# Altium schematic sheet LNA.SchDoc
size A4
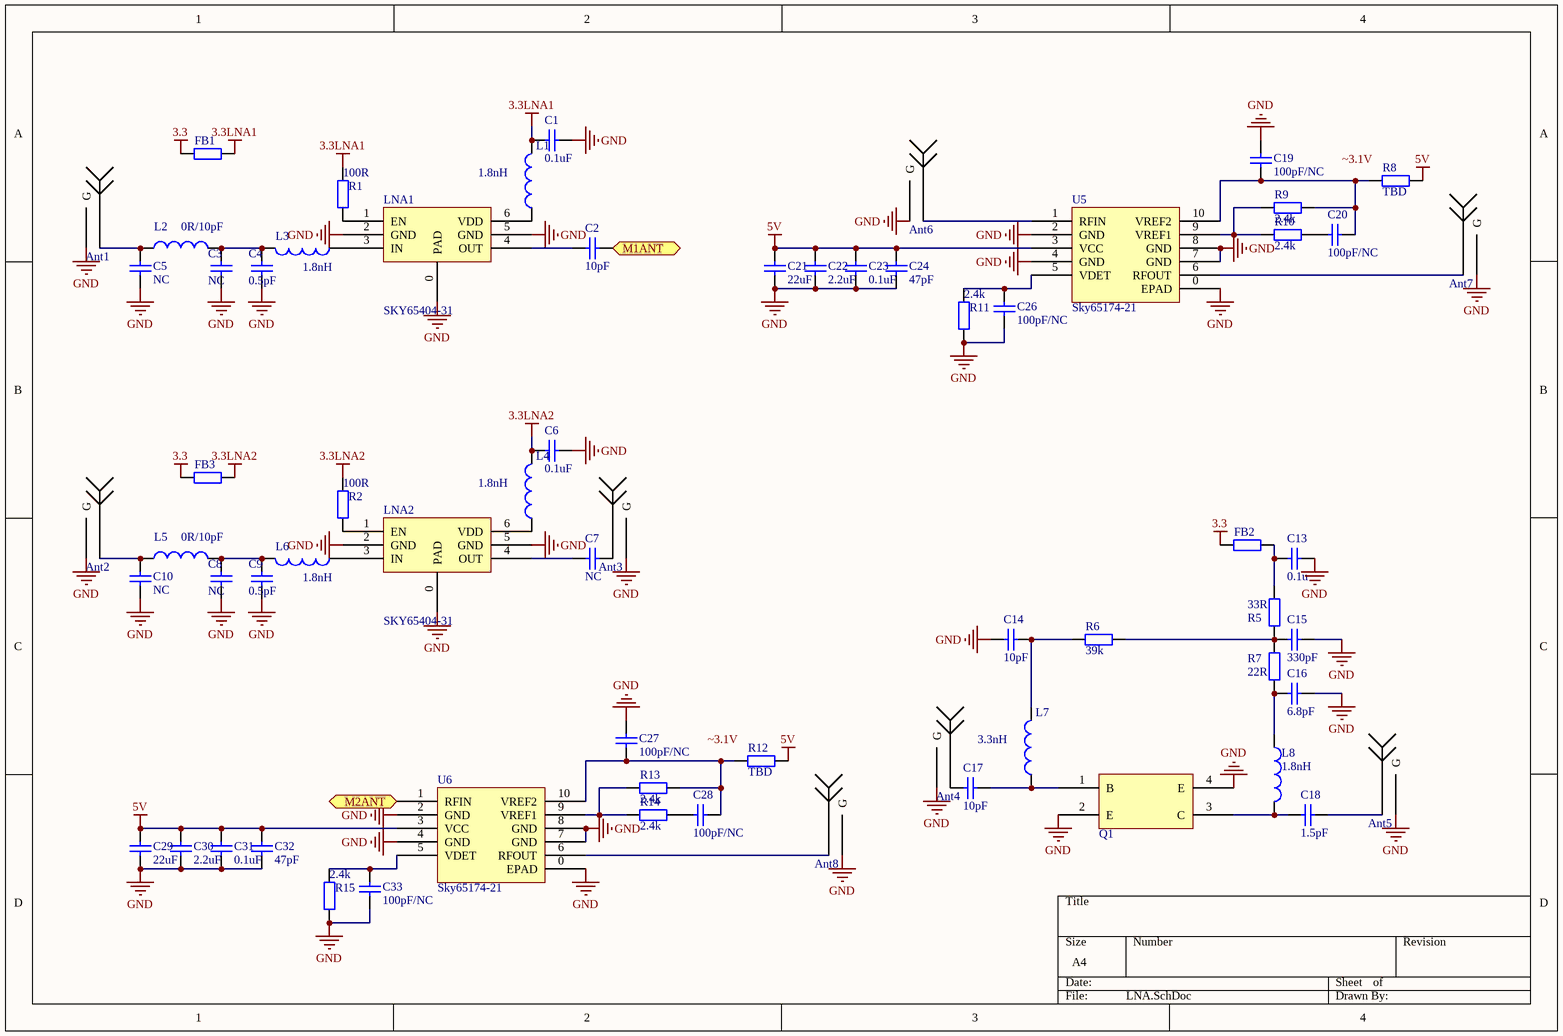
[diagram p0: LNA.SchDoc]

## Parts
Ant1  Antenna  [SMA-2]  (value not drawn)
Ant2  Antenna  [SMA-2]  (value not drawn)
Ant3  Antenna  [SMA-2]  (value not drawn)
Ant4  Antenna  [SMA-2]  (value not drawn)
Ant5  Antenna  [SMA-2]  (value not drawn)
Ant6  Antenna  [SMA-2]  (value not drawn)
Ant7  Antenna  [SMA-2]  (value not drawn)
Ant8  Antenna  [SMA-2]  (value not drawn)
C1  value 0.1uF  [0402]  (hidden comment: Cap)
C2  value 10pF  [0402]  (hidden comment: Cap)
C3  value NC  [0402]  (hidden comment: Cap)
C4  value 0.5pF  [0402]  (hidden comment: Cap)
C5  value NC  [0402]  (hidden comment: Cap)
C6  value 0.1uF  [0402]  (hidden comment: Cap)
C7  value NC  [0402]  (hidden comment: Cap)
C8  value NC  [0402]  (hidden comment: Cap)
C9  value 0.5pF  [0402]  (hidden comment: Cap)
C10  value NC  [0402]  (hidden comment: Cap)
C13  value 0.1u  [0402]  (hidden comment: Cap)
C14  value 10pF  [0402]  (hidden comment: Cap)
C15  value 330pF  [0402]  (hidden comment: Cap)
C16  value 6.8pF  [0402]  (hidden comment: Cap)
C17  value 10pF  [0402]  (hidden comment: Cap)
C18  value 1.5pF  [0402]  (hidden comment: Cap)
C19  value 100pF/NC  [0402]  (hidden comment: Cap)
C20  value 100pF/NC  [0402]  (hidden comment: Cap)
C21  value 22uF  [0805]  (hidden comment: Cap)
C22  value 2.2uF  [0603]  (hidden comment: Cap)
C23  value 0.1uF  [0402]  (hidden comment: Cap)
C24  value 47pF  [0402]  (hidden comment: Cap)
C26  value 100pF/NC  [0402]  (hidden comment: Cap)
C27  value 100pF/NC  [0402]  (hidden comment: Cap)
C28  value 100pF/NC  [0402]  (hidden comment: Cap)
C29  value 22uF  [0805]  (hidden comment: Cap)
C30  value 2.2uF  [0603]  (hidden comment: Cap)
C31  value 0.1uF  [0402]  (hidden comment: Cap)
C32  value 47pF  [0402]  (hidden comment: Cap)
C33  value 100pF/NC  [0402]  (hidden comment: Cap)
FB1  Res2  [0402]  (value not drawn)
FB2  Res2  [0402]  (value not drawn)
FB3  Res2  [0402]  (value not drawn)
L1  value 1.8nH  [0402]  (hidden comment: Inductor)
L2  value 0R/10pF  [0402]  (hidden comment: Inductor)
L3  value 1.8nH  [0402]  (hidden comment: Inductor)
L4  value 1.8nH  [0402]  (hidden comment: Inductor)
L5  value 0R/10pF  [0402]  (hidden comment: Inductor)
L6  value 1.8nH  [0402]  (hidden comment: Inductor)
L7  value 3.3nH  [0402]  (hidden comment: Inductor)
L8  value 1.8nH  [0402]  (hidden comment: Inductor)
LNA1  SKY65404-31  [SKY65404-31]
LNA2  SKY65404-31  [SKY65404-31]
Q1  RF_BJT  [SOT343-4(RF)]  (value not drawn)
R1  value 100R  [0402]  (hidden comment: Res2)
R2  value 100R  [0402]  (hidden comment: Res2)
R5  value 33R  [0402]  (hidden comment: Res2)
R6  value 39k  [0402]  (hidden comment: Res2)
R7  value 22R  [0402]  (hidden comment: Res2)
R8  value TBD  [0402]  (hidden comment: Res2)
R9  value 2.4k  [0402]  (hidden comment: Res2)
R10  value 2.4k  [0402]  (hidden comment: Res2)
R11  value 2.4k  [0402]  (hidden comment: Res2)
R12  value TBD  [0402]  (hidden comment: Res2)
R13  value 2.4k  [0402]  (hidden comment: Res2)
R14  value 2.4k  [0402]  (hidden comment: Res2)
R15  value 2.4k  [0402]  (hidden comment: Res2)
U5  Sky65174-21  [SKY65174-21]
U6  Sky65174-21  [SKY65174-21]

## Ports
M1ANT, M2ANT

## Nets
3.3: FB1.1 FB2.1 FB3.1
3.3LNA1: C1.2 FB1.2 L1.2 R1.2
3.3LNA2: C6.2 FB3.2 L4.2 R2.2
5V: C21.1 C22.1 C23.1 C24.1 C29.1 C30.1 C31.1 C32.1 R8.1 R12.1 U5.3(VCC) U6.3(VCC)
GND: Ant1.GND(G) Ant2.GND(G) Ant3.GND(G) Ant4.GND(G) Ant5.GND(G) Ant6.GND(G) Ant7.GND(G) Ant8.GND(G) C1.1 C3.1 C4.1 C5.1 C6.1 C8.1 C9.1 C10.1 C13.1 C14.2 C15.2 C16.1 C19.1 C21.2 C22.2 C23.2 C24.2 C26.2 C27.1 C29.2 C30.2 C31.2 C32.2 C33.2 LNA1.0(PAD) LNA1.2(GND) LNA1.5(GND) LNA2.0(PAD) LNA2.2(GND) LNA2.5(GND) Q1.2(E) Q1.4(E) R11.1 R15.1 U5.0(EPAD) U5.2(GND) U5.4(GND) U5.7(GND) U5.8(GND) U6.0(EPAD) U6.2(GND) U6.4(GND) U6.7(GND) U6.8(GND)
M1ANT: C2.2 ; port M1ANT
M2ANT: U6.1(RFIN) ; port M2ANT
NetAnt1_1: Ant1.1 C5.2 L2.1
NetAnt2_1: Ant2.1 C10.2 L5.1
NetAnt3_1: Ant3.1 C7.2
NetAnt4_1: Ant4.1 C17.2
NetAnt5_1: Ant5.1 C18.1
NetAnt6_1: Ant6.1 U5.1(RFIN)
NetAnt7_1: Ant7.1 U5.6(RFOUT)
NetAnt8_1: Ant8.1 U6.6(RFOUT)
NetC2_1: C2.1 LNA1.4(OUT)
NetC3_2: C3.2 C4.2 L2.2 L3.2
NetC7_1: C7.1 LNA2.4(OUT)
NetC8_2: C8.2 C9.2 L5.2 L6.2
NetC13_2: C13.2 FB2.2 R5.2
NetC14_1: C14.1 L7.2 R6.2
NetC15_1: C15.1 R5.1 R6.1 R7.1
NetC16_2: C16.2 L8.1 R7.2
NetC17_1: C17.1 L7.1 Q1.1(B)
NetC18_2: C18.2 L8.2 Q1.3(C)
NetC19_2: C19.2 C20.2 R8.2 R9.1 U5.10(VREF2)
NetC20_1: C20.1 R10.1
NetC26_1: C26.1 R11.2 U5.5(VDET)
NetC27_2: C27.2 C28.2 R12.2 R13.1 U6.10(VREF2)
NetC28_1: C28.1 R14.1
NetC33_1: C33.1 R15.2 U6.5(VDET)
NetL1_1: L1.1 LNA1.6(VDD)
NetL3_1: L3.1 LNA1.3(IN)
NetL4_1: L4.1 LNA2.6(VDD)
NetL6_1: L6.1 LNA2.3(IN)
NetLNA1_1: LNA1.1(EN) R1.1
NetLNA2_1: LNA2.1(EN) R2.1
NetR9_2: R9.2 R10.2 U5.9(VREF1)
NetR13_2: R13.2 R14.2 U6.9(VREF1)

## Notes on the sheet
- Labels drawn without touching a wire or pin: ~3.1V

## Library data of the parts
C1-C10 C13-C24 C26-C33 = Cap: Capacitor; Published: 8-Jun-2000; LatestRevisionDate: 17-Jul-2002; LatestRevisionNote: Re-released for DXP Platform.; PackageReference: RAD-0.3; Publisher: Altium Limited; PackageDescription: Radial Cap, Thru-Hole; 2 Leads; 0.3 in Pin Spacing
FB1-FB3 = Res2: Resistor; Value: FB; Published: 8-Jun-2000; LatestRevisionDate: 17-Jul-2002; LatestRevisionNote: Re-released for DXP Platform.; PackageReference: AXIAL-0.4; Publisher: Altium Limited; PackageDescription: Axial Device, Thru-Hole; 2 Leads; 0.4 in Pin Spacing
L1-L8 = Inductor: Code_IEC: 1005; Published: 8-Jun-2000; LatestRevisionDate: 29-May-2009; LatestRevisionNote: IPC-7351 Footprint Added.; PackageReference: 0402-A; Publisher: Altium Limited; PackageDescription: Chip Inductor; Code_JEITA: 0402
R1 R2 R5-R15 = Res2: Resistor; Published: 8-Jun-2000; LatestRevisionDate: 17-Jul-2002; LatestRevisionNote: Re-released for DXP Platform.; PackageReference: AXIAL-0.4; Publisher: Altium Limited; PackageDescription: Axial Device, Thru-Hole; 2 Leads; 0.4 in Pin Spacing